# Altium project omni robot main board v2.PrjPcb
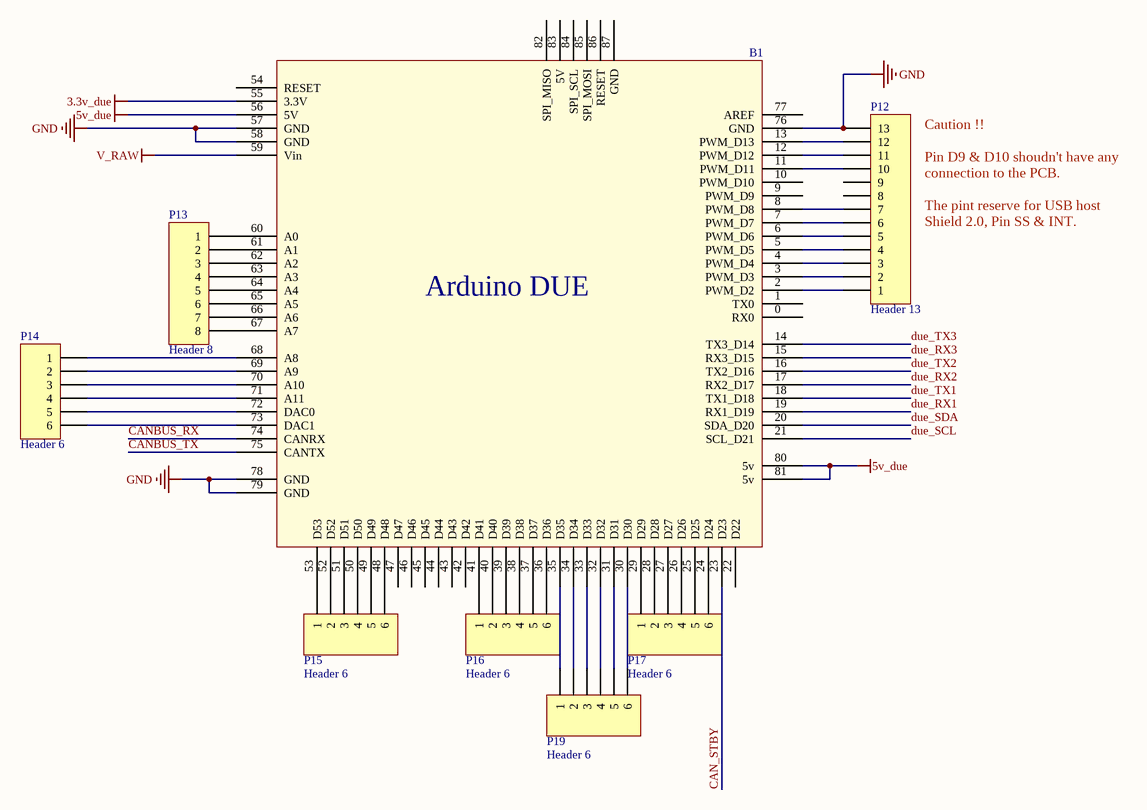
[diagram p0: arduino due connection.SchDoc]
2 sheets, 24 parts. Net scope: global (net labels, ports and power ports of the same name join across sheets).
Board file: omni robot main board v2.PcbDoc
Sheets:
  arduino due connection.SchDoc
  outgoing connection.SchDoc

## Sheet arduino due connection.SchDoc
size A4

### Parts
B1  Arduino due  [arduino_due_pinmap_v3]  (value not drawn)
P12  Header 13  [HDR1X13]
P13  Header 8  [HDR1X8]
P14  Header 6  [HDR1X6]
P15  Header 6  [HDR1X6]
P16  Header 6  [HDR1X6]
P17  Header 6  [HDR1X6]
P19  Header 6  [HDR1X6]

### Nets
3.3v_due: B1.55(3.3V)
5v_due: B1.56(5V) B1.80(5v) B1.81(5v)
GND: B1.57(GND) B1.58(GND) B1.76(GND) B1.78(GND) B1.79(GND) P12.13
V_RAW: B1.59(Vin)
CAN_STBY: B1.23(D23)
CANBUS_RX: B1.74(CANRX)
CANBUS_TX: B1.75(CANTX)
due_RX1: B1.19(RX1_D19)
due_RX2: B1.17(RX2_D17)
due_RX3: B1.15(RX3_D15)
due_SCL: B1.21(SCL_D21)
due_SDA: B1.20(SDA_D20)
due_TX1: B1.18(TX1_D18)
due_TX2: B1.16(TX2_D16)
due_TX3: B1.14(TX3_D14)
NetB1_2: B1.2(PWM_D2) P12.1
NetB1_3: B1.3(PWM_D3) P12.2
NetB1_4: B1.4(PWM_D4) P12.3
NetB1_5: B1.5(PWM_D5) P12.4
NetB1_6: B1.6(PWM_D6) P12.5
NetB1_7: B1.7(PWM_D7) P12.6
NetB1_8: B1.8(PWM_D8) P12.7
NetB1_11: B1.11(PWM_D11) P12.10
NetB1_12: B1.12(PWM_D12) P12.11
NetB1_13: B1.13(PWM_D13) P12.12
NetB1_24: B1.24(D24) P17.6
NetB1_25: B1.25(D25) P17.5
NetB1_26: B1.26(D26) P17.4
NetB1_27: B1.27(D27) P17.3
NetB1_28: B1.28(D28) P17.2
NetB1_29: B1.29(D29) P17.1
NetB1_30: B1.30(D30) P19.6
NetB1_31: B1.31(D31) P19.5
NetB1_32: B1.32(D32) P19.4
NetB1_33: B1.33(D33) P19.3
NetB1_34: B1.34(D34) P19.2
NetB1_35: B1.35(D35) P19.1
NetB1_36: B1.36(D36) P16.6
NetB1_37: B1.37(D37) P16.5
NetB1_38: B1.38(D38) P16.4
NetB1_39: B1.39(D39) P16.3
NetB1_40: B1.40(D40) P16.2
NetB1_41: B1.41(D41) P16.1
NetB1_48: B1.48(D48) P15.6
NetB1_49: B1.49(D49) P15.5
NetB1_50: B1.50(D50) P15.4
NetB1_51: B1.51(D51) P15.3
NetB1_52: B1.52(D52) P15.2
NetB1_53: B1.53(D53) P15.1
NetB1_60: B1.60(A0) P13.1
NetB1_61: B1.61(A1) P13.2
NetB1_62: B1.62(A2) P13.3
NetB1_63: B1.63(A3) P13.4
NetB1_64: B1.64(A4) P13.5
NetB1_65: B1.65(A5) P13.6
NetB1_66: B1.66(A6) P13.7
NetB1_67: B1.67(A7) P13.8
NetB1_68: B1.68(A8) P14.1
NetB1_69: B1.69(A9) P14.2
NetB1_70: B1.70(A10) P14.3
NetB1_71: B1.71(A11) P14.4
NetB1_72: B1.72(DAC0) P14.5
NetB1_73: B1.73(DAC1) P14.6

Not connected (* = marked no-connect by the designer): B1 0(RX0) 1(TX0) 9(PWM_D9) 10(PWM_D10) 22(D22) 42(D42) 43(D43) 44(D44) 45(D45) 46(D46) 47(D47) 54(RESET) 77(AREF) 82(SPI_MISO) 83(5V) 84(SPI_SCL) 85(SPI_MOSI) 86(RESET) 87(GND); P12 8 9

### Notes on the sheet
- Caution !!
  Pin D9 & D10 shoudn't have any connection to the PCB.
  The pint reserve for USB host Shield 2.0, Pin SS & INT.
- (in symbol arduino due) Arduino DUE

### Library data of the parts
P12 = Header 13: Header, 13-Pin; LatestRevisionDate: 17-Jul-2002; LatestRevisionNote: Re-released for DXP Platform.; Publisher: Altium Limited
P13 = Header 8: Header, 8-Pin; LatestRevisionDate: 17-Jul-2002; LatestRevisionNote: Re-released for DXP Platform.; Publisher: Altium Limited
P14-P17 P19 = Header 6: Header, 6-Pin; LatestRevisionDate: 17-Jul-2002; LatestRevisionNote: Re-released for DXP Platform.; Publisher: Altium Limited

## Sheet outgoing connection.SchDoc
size A4
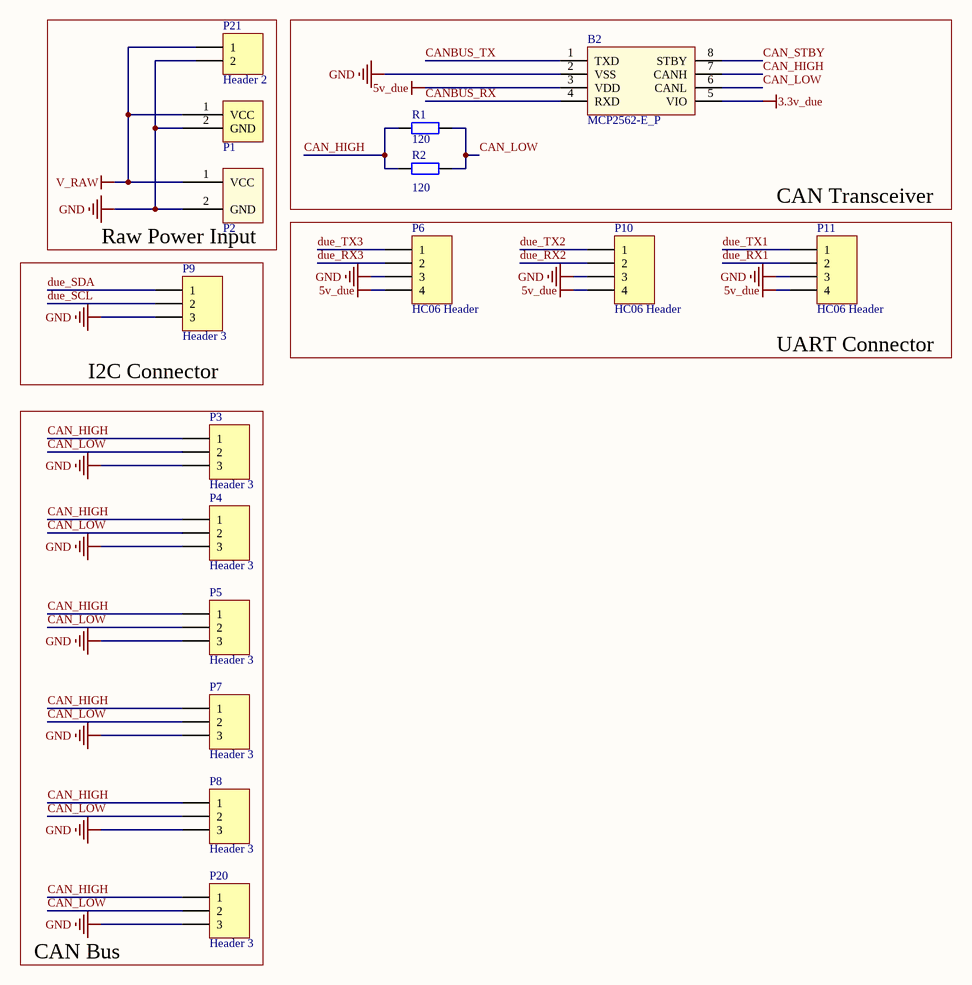
[diagram p1: outgoing connection.SchDoc]

### Parts
B2  MCP2562-E_P  [DIP781W56P254L950H533Q8N]
P1  5557 Connector  [5557_connector]  (value not drawn)
P2  big Pin power port  [bigPin_power_port]  (value not drawn)
P3  Header 3  [HDR1X3]
P4  Header 3  [HDR1X3]
P5  Header 3  [HDR1X3]
P6  HC06 Header  [HDR1X4]
P7  Header 3  [HDR1X3]
P8  Header 3  [HDR1X3]
P9  Header 3  [HDR1X3]
P10  HC06 Header  [HDR1X4]
P11  HC06 Header  [HDR1X4]
P20  Header 3  [HDR1X3]
P21  Header 2  [HDR1X2]
R1  value 120  [AXIAL-0.4]  (hidden comment: Res2)
R2  value 120  [AXIAL-0.4]  (hidden comment: Res2)

### Nets
3.3v_due: B2.5(VIO)
5v_due: B2.3(VDD) P6.4 P10.4 P11.4
GND: B2.2(VSS) P1.2(GND) P2.2(GND) P3.3 P4.3 P5.3 P6.3 P7.3 P8.3 P9.3 P10.3 P11.3 P20.3 P21.2
V_RAW: P1.1(VCC) P2.1(VCC) P21.1
CAN_HIGH: B2.7(CANH) P3.1 P4.1 P5.1 P7.1 P8.1 P20.1 R1.1 R2.1
CAN_LOW: B2.6(CANL) P3.2 P4.2 P5.2 P7.2 P8.2 P20.2 R1.2 R2.2
CAN_STBY: B2.8(STBY)
CANBUS_RX: B2.4(RXD)
CANBUS_TX: B2.1(TXD)
due_RX1: P11.2
due_RX2: P10.2
due_RX3: P6.2
due_SCL: P9.2
due_SDA: P9.1
due_TX1: P11.1
due_TX2: P10.1
due_TX3: P6.1

### Notes on the sheet
- (near P11) CAN Transceiver
- (near P2) Raw Power Input
- (near P11) UART Connector
- I2C Connector
- (near P20) CAN Bus Connector

### Library data of the parts
B2 = MCP2562-E_P: CAN Transceiver 1Mbps 5V 125degC PDIP8 Microchip MCP2562-E/P, CAN Transceiver 1-channel IEC 61000-4-2, 8-Pin PDIP; Geometry.Height: 5.334mm; Supplier_Name: RS; RS Part Number: 7990225; Manufacturer_Name: Microchip; Manufacturer_Part_Number: MCP2562-E/P; Allied_Number: *; Other Part Number: *; Datasheet Link: http://uk.rs-online.com/webdocs/1380/0900766b81380aaf.pdf; 3D Package: *
P1 = 5557_connector
P3-P5 P7-P9 P20 = Header 3: Header, 3-Pin; LatestRevisionDate: 17-Jul-2002; LatestRevisionNote: Re-released for DXP Platform.; Publisher: Altium Limited
P6 P10 P11 = Header 4: Header, 4-Pin; LatestRevisionDate: 17-Jul-2002; LatestRevisionNote: Re-released for DXP Platform.; Publisher: Altium Limited
P21 = Header 2: Header, 2-Pin; LatestRevisionDate: 17-Jul-2002; LatestRevisionNote: Re-released for DXP Platform.; Publisher: Altium Limited
R1 R2 = Res2: Resistor; Published: 8-Jun-2000; LatestRevisionDate: 17-Jul-2002; LatestRevisionNote: Re-released for DXP Platform.; PackageReference: AXIAL-0.4; Publisher: Altium Limited; PackageDescription: Axial Device, Thru-Hole; 2 Leads; 0.4 in Pin Spacing

## Nets that join several sheets
3.3v_due: arduino due connection (B1.55), outgoing connection (B2.5)
5v_due: arduino due connection (B1.56 B1.80 B1.81), outgoing connection (B2.3 P6.4 P10.4 P11.4)
GND: arduino due connection (6 pins), outgoing connection (14 pins)
V_RAW: arduino due connection (B1.59), outgoing connection (P1.1 P2.1 P21.1)
CAN_STBY: arduino due connection (B1.23), outgoing connection (B2.8)
CANBUS_RX: arduino due connection (B1.74), outgoing connection (B2.4)
CANBUS_TX: arduino due connection (B1.75), outgoing connection (B2.1)
due_RX1: arduino due connection (B1.19), outgoing connection (P11.2)
due_RX2: arduino due connection (B1.17), outgoing connection (P10.2)
due_RX3: arduino due connection (B1.15), outgoing connection (P6.2)
due_SCL: arduino due connection (B1.21), outgoing connection (P9.2)
due_SDA: arduino due connection (B1.20), outgoing connection (P9.1)
due_TX1: arduino due connection (B1.18), outgoing connection (P11.1)
due_TX2: arduino due connection (B1.16), outgoing connection (P10.1)
due_TX3: arduino due connection (B1.14), outgoing connection (P6.1)